# EAGLE design Fuente de Poder Taylor (EAGLE 9.6.2)
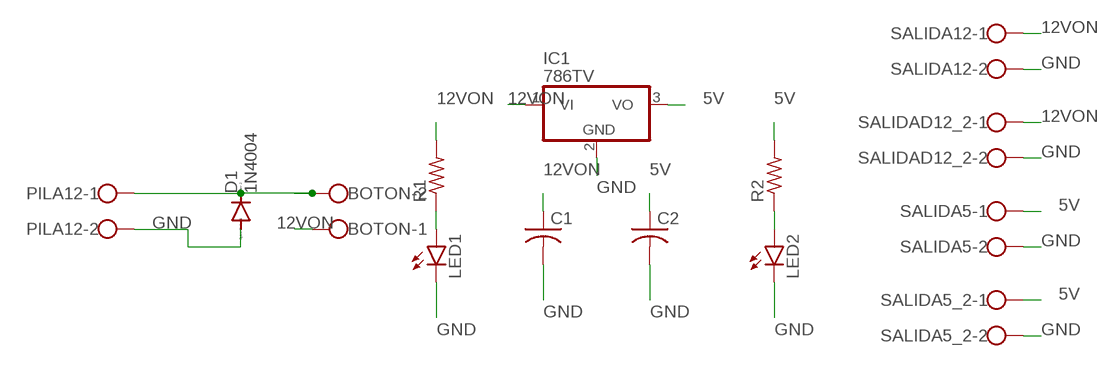
[diagram p0: schematic, sheet 1]

## Parts
BOTON  W237-102  [W237-102]
C1  C-US025-024X044  [C025-024X044]
C2  C-US025-024X044  [C025-024X044]
D1  1N4004  [DO41-10]
IC1  786TV  [TO220V]
LED1  LED3MM  [LED3MM]
LED2  LED3MM  [LED3MM]
PILA12  W237-102  [W237-102]
R1  R-US_0204/7  [0204/7]
R2  R-US_0204/7  [0204/7]
SALIDA5  W237-102  [W237-102]
SALIDA5_2  W237-102  [W237-102]
SALIDA12  W237-102  [W237-102]
SALIDAD12_2  W237-102  [W237-102]

## Nets
5V: C2.1 IC1.3(VO) R2.2 SALIDA5.1 SALIDA5_2.1
12VIN: BOTON.2 D1.C PILA12.1
12VON: BOTON.1 C1.1 IC1.1(VI) R1.2 SALIDA12.1 SALIDAD12_2.1
GND: C1.2 C2.2 D1.A IC1.2(GND) LED1.K(C) LED2.K(C) PILA12.2 SALIDA5.2 SALIDA5_2.2 SALIDA12.2 SALIDAD12_2.2
N$1: LED1.A R1.1
N$2: LED2.A R2.1

## Library data of the parts
BOTON SALIDA5 SALIDA5_2 SALIDA12 SALIDAD12_2 = con-wago-500:W237-102: WAGO SCREW CLAMP; MPN: 237-102; OC_FARNELL: unknown; OC_NEWARK: 70K9898
C1 C2 = rcl:C-US: CAPACITOR, American symbol; SPICEPREFIX: C
D1 = diode:1N4004: DIODE general purpose rectifier, 1 A
IC1 = linear:78*: Positive VOLTAGE REGULATOR Source: http://cache.national.com/ds/LM/LM78L05.pdf http://www.fairchildsemi.com/ds/LM/LM7805.pdf
LED1 LED2 = led:LED: LED OSRAM: - CHIPLED LG R971, LG N971, LY N971, LG Q971, LY Q971, LO R971, LY R971 LH N974, LH R974 LS Q976, LO Q976, LY Q976 LO Q996 - Hyper CHIPLED LW Q18S LB Q993, LB Q99A, LB R99A - SideLED LS A670, LO A670, LY A670, LG A670, LP A670 LB A673, LV A673, LT A673, LW A673 LH A674 LY A675 LS A676, LA A676, LO A676, LY A676, LW A676 LS A679, LY A679, LG A679 - Hyper Micro SIDELED® LS Y876, LA Y876, LO Y876, LY Y876 LT Y87S - SmartLED LW L88C, LW L88S LB L89C, LB L89S, LG L890 LS L89K, LO L89K, LY L89K LS L896, LA L896, LO L896, LY L896 - TOPLED LS T670, LO T670, LY T670, LG T670, LP T670 LSG T670, LSP T670, LSY T670, LOP T670, LYG T670 LG T671, LOG T671, LSG T671 LB T673, LV T673, LT T673, LW T673 LH T674 LS T676, LA T676, LO T676, LY T676, LB T676, LH T676, LSB T676, LW T676 LB T67C, LV T67C, LT T67C, LS T67K, LO T67K, LY T67K, LW E67C LS E67B, LA E67B, LO E67B, LY E67B, LB E67C, LV E67C, LT E67C LW T67C LS T679, LY T679, LG T679 LS T770, LO T770, LY T770, LG T770, LP T770 LB T773, LV T773, LT T773, LW T773 LH T774 LS E675, LA E675, LY E675, LS T675 LS T776, LA T776, LO T776, LY T776, LB T776 LHGB T686 LT T68C, LB T68C - Hyper Mini TOPLED® LB M676 - Mini TOPLED Santana® LG M470 LS M47K, LO M47K, LY M47K Source: http://www.osram.convergy.de LUXEON: - LUMILED® LXK2-PW12-R00, LXK2-PW12-S00, LXK2-PW14-U00, LXK2-PW14-V00 LXK2-PM12-R00, LXK2-PM12-S00, LXK2-PM14-U00 LXK2-PE12-Q00, LXK2-PE12-R00, LXK2-PE12-S00, LXK2-PE14-T00, LXK2-PE14-U00 LXK2-PB12-K00, LXK2-PB12-L00, LXK2-PB12-M00, LXK2-PB14-N00, LXK2-PB14-P00, LXK2-PB14-Q00 LXK2-PR12-L00, LXK2-PR12-M00, LXK2-PR14-Q00, LXK2-PR14-R00 LXK2-PD12-Q00, LXK2-PD12-R00, LXK2-PD12-S00 LXK2-PH12-R00, LXK2-PH12-S00 LXK2-PL12-P00, LXK2-PL12-Q00, LXK2-PL12-R00 Source: www.luxeon.com KINGBRIGHT: KA-3528ASYC Source: www.kingbright.com
PILA12 = con-wago-500:W237-102: WAGO SCREW CLAMP; MPN: 237-102; OC_FARNELL: unknown; OC_NEWARK: 70K9898; SPICEPREFIX: X
R1 R2 = rcl:R-US_: RESISTOR, American symbol; SPICEPREFIX: R

## Board
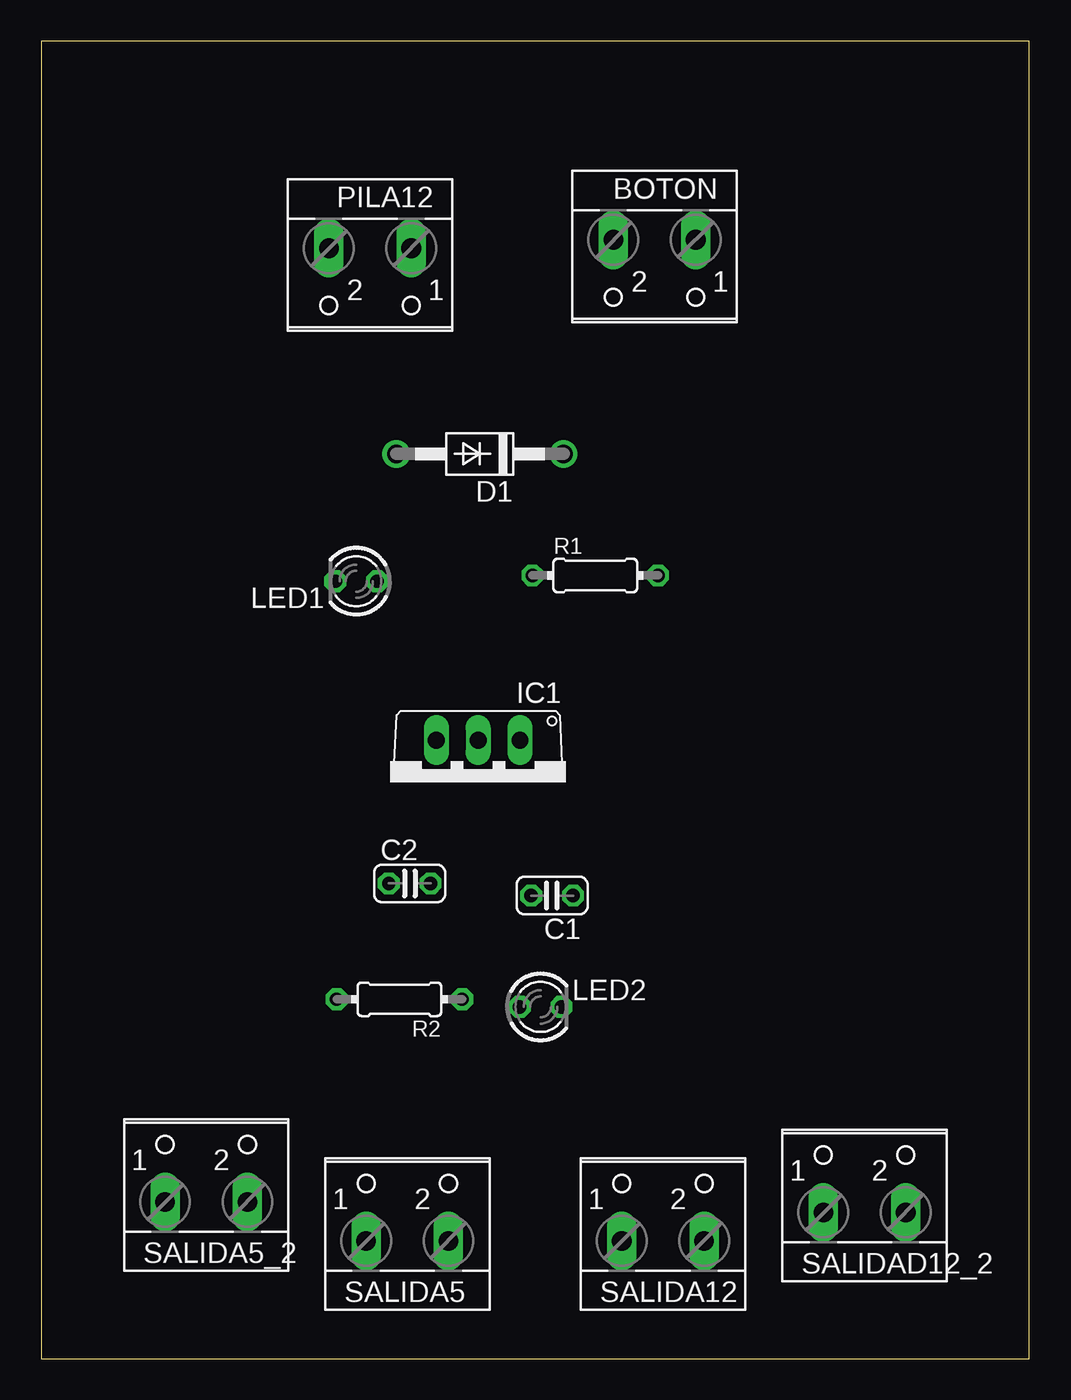
[diagram p1: board, top side]
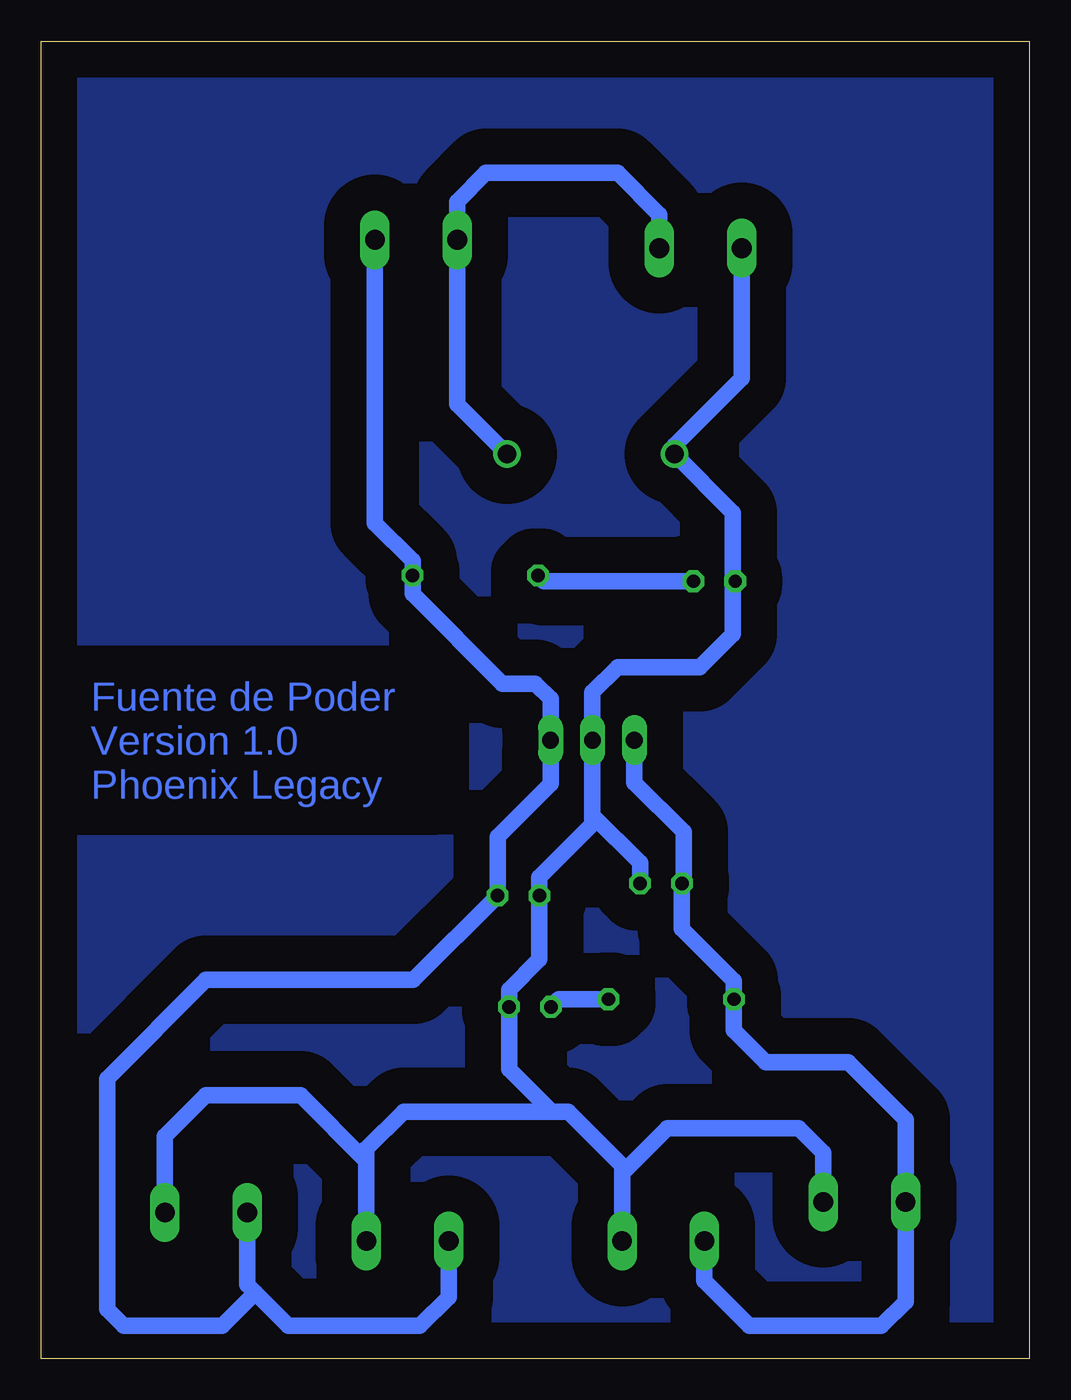
[diagram p2: board, bottom side, seen from below]

Size 60 x 80 mm. Coordinates in mm from the lower left corner, seen from the top.
Outline: 0,0 60,0 60,80 0,80 0,0
Copper layers (1*16): Top 0.035mm / dielectric 1.5mm / Bottom 0.035mm
Design rules "default": minimum track width 6mil, minimum drill 0.35mm, track to track 6mil, track to pad 6mil, pad to pad 6mil, via to via 6mil, smd to smd 6mil, copper to edge 40mil, drill to drill 6mil, minimum pad ring 10mil, minimum via ring 8mil, stop-mask expansion 4mil, vias tented up to drill 0mil, thermal gap 10mil

### Footprints (pad centres in the part's own frame; a part is rotated, then mirrored left to right if it is on the bottom)
W237-102 = drill 1.194 long: 1 -2.5,-1.27; 2 2.5,-1.27
C025-024X044 = drill 0.813 octagon: 1 -1.27,0; 2 1.27,0
DO41-10 = drill 1.118: A 5.08,0; C -5.08,0
TO220V = drill 1.016 long: 1 -2.54,-2.54; 2 0,-2.54; 3 2.54,-2.54
LED3MM = drill 0.813 octagon: A -1.27,0; K 1.27,0
0204/7 = drill 0.813 octagon: 1 -3.81,0; 2 3.81,0

### Placement (x,y rotation side)
BOTON  37.24,66.67 180 top
C1  31.02,28.13 180 top
C2  22.37,28.86 0 top
D1  26.64,54.94 180 top
IC1  26.53,35.02 180 top
LED1  19.13,47.21 180 top
LED2  30.32,21.37 0 top
PILA12  19.97,66.16 180 top
R1  33.64,47.56 0 top
R2  21.75,21.83 180 top
SALIDA5  22.23,8.43 0 top
SALIDA5_2  10.02,10.8 0 top
SALIDA12  37.75,8.43 0 top
SALIDAD12_2  49.99,10.16 0 top

### Tracks (layer width: path | path; a pad name or v marks a point on that pad's centre or on a via)
5V
  Bottom 1.016: SALIDA5.1 19.73,4.73 17,2 9,2 7.52,3.48 SALIDA5_2.1 7.52,14.52 11,18 16,18 17.94,19.94 R2.2 17.94,22.94 21.1,26.1 C2.1 21,28.96 21,32 23.99,34.99 IC1.3
12VIN
  Bottom 1.016: PILA12.1 22.47,69.47 25,72 33,72 34.74,70.26 BOTON.2 34.74,57.96 D1.C
12VON
  Bottom 1.016: SALIDA12.1 35.25,3.75 37,2 45,2 47,4 | SALIDAD12_2.1 47.49,4.49 47,4 | BOTON.1 39.74,50.74 37.45,48.45 R1.2 37.45,46.45 32,41 30,41 29.07,40.07 IC1.1 29.07,34.93 32.29,31.71 C1.1 37.42,23 50,23 56,17 56,3 55,2 49,2 47,4
GND
  Bottom 1.016: PILA12.2 17.47,59.53 21.56,55.44 D1.A 18,51.38 18,47.35 LED1.K 18,47.07 18,44 20,42 25,42 26.53,40.47 IC1.2 26.53,33 | 26.53,33 26.53,32.47 29.75,29.25 C1.2 29.75,24.25 31.59,22.41 LED2.K 31.59,17.59 29,15 | 26.53,33 23.64,30.11 C2.2 | SALIDA5_2.2 12.52,12.52 14,14 22,14 24.73,11.27 SALIDA5.2 24.73,11.73 28,15 29,15 | 29,15 38,15 40.25,12.75 40.25,12 | 40.25,12 SALIDA12.2 | 40.25,12 44.25,16 50,16 52.49,13.51 SALIDAD12_2.2
N$1
  Bottom 1.016: LED1.A 29.48,47.21 R1.1
N$2
  Bottom 1.016: R2.1 28.59,21.83 LED2.A
PLACA
  pour Bottom (isolate 2.184): 0,80 60,80 60,0 0,0

### Text on the board
Bottom: Fuente de Poder / Version 1.0 / Phoenix Legacy